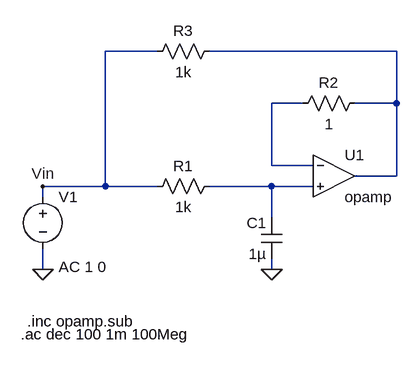
[diagram p0: schematic ejer3b.asc]
ejer3b.asc, the LTspice schematic file:
Version 4
SHEET 1 880 680
WIRE 192 -64 112 -64
WIRE 560 -64 272 -64
WIRE 416 16 368 16
WIRE 560 16 560 -64
WIRE 560 16 496 16
WIRE 368 112 368 16
WIRE 432 112 368 112
WIRE 560 128 560 16
WIRE 560 128 496 128
WIRE 112 144 112 -64
WIRE 112 144 16 144
WIRE 192 144 112 144
WIRE 368 144 272 144
WIRE 432 144 368 144
WIRE 16 160 16 144
WIRE 368 192 368 144
WIRE 16 272 16 240
WIRE 368 272 368 256
FLAG 368 272 0
FLAG 16 272 0
FLAG 16 144 Vin
SYMBOL voltage 16 144 R0
WINDOW 123 24 124 Left 2
WINDOW 39 0 0 Left 0
SYMATTR InstName V1
SYMATTR Value ""
SYMATTR Value2 AC 1 0
SYMBOL res 288 128 R90
WINDOW 0 0 56 VBottom 2
WINDOW 3 32 56 VTop 2
SYMATTR InstName R1
SYMATTR Value 1k
SYMBOL res 512 0 R90
WINDOW 0 0 56 VBottom 2
WINDOW 3 32 56 VTop 2
SYMATTR InstName R2
SYMATTR Value 1
SYMBOL res 288 -80 R90
WINDOW 0 0 56 VBottom 2
WINDOW 3 32 56 VTop 2
SYMATTR InstName R3
SYMATTR Value 1k
SYMBOL cap 384 256 R180
WINDOW 0 24 56 Left 2
WINDOW 3 24 8 Left 2
SYMATTR InstName C1
SYMATTR Value 1µ
SYMBOL OpAmps\\opamp 464 64 R0
SYMATTR InstName U1
SYMATTR SpiceLine Aol=100Meg
SYMATTR SpiceLine2 GBW=100Meg
TEXT -8 352 Left 2 !.inc opamp.sub
TEXT -18 372 Left 2 !.ac dec 100 1m 100Meg

The netlist it stands for:
* ejer3b.asc
V1 Vin 0 AC 1 0
R1 N003 Vin 1k
R2 N001 N002 1
R3 N001 Vin 1k
C1 0 N003 1µ
XU1 N002 N003 N001 opamp Aol=100Meg GBW=100Meg  ; pins invin noninvin out
.inc opamp.sub
.ac dec 100 1m 100Meg
.backanno
.end